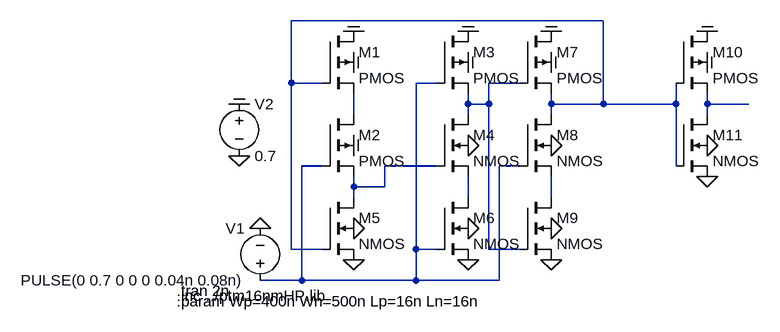
[diagram p0: schematic TSPC_divide-by-2.asc]
TSPC_divide-by-2.asc, the LTspice schematic file:
Version 4
SHEET 1 880 680
WIRE 624 48 144 48
WIRE 144 144 144 48
WIRE 192 144 144 144
WIRE 368 144 336 144
WIRE 496 144 448 144
WIRE 416 176 416 160
WIRE 448 176 448 144
WIRE 448 176 416 176
WIRE 544 176 544 160
WIRE 624 176 624 48
WIRE 624 176 544 176
WIRE 736 176 736 144
WIRE 736 176 624 176
WIRE 784 176 784 160
WIRE 848 176 784 176
WIRE 240 192 240 160
WIRE 416 192 416 176
WIRE 544 192 544 176
WIRE 784 192 784 176
WIRE 192 272 160 272
WIRE 368 272 288 272
WIRE 496 272 464 272
WIRE 736 272 736 176
WIRE 240 304 240 288
WIRE 288 304 288 272
WIRE 288 304 240 304
WIRE 240 320 240 304
WIRE 416 320 416 288
WIRE 544 320 544 288
WIRE 144 400 144 144
WIRE 192 400 144 400
WIRE 336 400 336 144
WIRE 368 400 336 400
WIRE 448 400 448 176
WIRE 496 400 448 400
WIRE 160 448 160 272
WIRE 160 448 96 448
WIRE 336 448 336 400
WIRE 336 448 160 448
WIRE 464 448 464 272
WIRE 464 448 336 448
FLAG 240 416 0
FLAG 240 368 0
FLAG 240 240 COM
FLAG 240 112 COM
FLAG 240 64 COM
FLAG 416 112 COM
FLAG 416 64 COM
FLAG 416 240 0
FLAG 416 416 0
FLAG 416 368 0
FLAG 544 112 COM
FLAG 544 64 COM
FLAG 544 240 0
FLAG 544 416 0
FLAG 544 368 0
FLAG 96 368 0
FLAG 64 176 COM
FLAG 64 256 0
FLAG 784 112 COM
FLAG 784 64 COM
FLAG 784 240 0
FLAG 784 288 0
SYMBOL pmos4 192 64 R0
SYMATTR InstName M1
SYMATTR Value2 l={Lp} w={Wp}
SYMBOL pmos4 192 192 R0
SYMATTR InstName M2
SYMATTR Value2 l={Lp} w={Wp}
SYMBOL nmos4 192 320 R0
SYMATTR InstName M5
SYMATTR Value2 l={Ln} w={Wn}
SYMBOL pmos4 368 64 R0
SYMATTR InstName M3
SYMATTR Value2 l={Lp} w={Wp}
SYMBOL nmos4 368 192 R0
SYMATTR InstName M4
SYMATTR Value2 l={Ln} w={Wn}
SYMBOL nmos4 368 320 R0
SYMATTR InstName M6
SYMATTR Value2 l={Ln} w={Wn}
SYMBOL pmos4 496 64 R0
SYMATTR InstName M7
SYMATTR Value2 l={Lp} w={Wp}
SYMBOL nmos4 496 192 R0
SYMATTR InstName M8
SYMATTR Value2 l={Ln} w={Wn}
SYMBOL nmos4 496 320 R0
SYMATTR InstName M9
SYMATTR Value2 l={Ln} w={Wn}
SYMBOL voltage 96 464 R180
WINDOW 0 24 96 Left 2
WINDOW 3 24 16 Left 2
WINDOW 123 0 0 Left 0
WINDOW 39 0 0 Left 0
SYMATTR InstName V1
SYMATTR Value PULSE(0 0.7 0 0 0 0.04n 0.08n)
SYMBOL voltage 64 160 R0
WINDOW 123 0 0 Left 0
WINDOW 39 0 0 Left 0
SYMATTR InstName V2
SYMATTR Value 0.7
SYMBOL pmos4 736 64 R0
SYMATTR InstName M10
SYMATTR Value2 l=16n w=250n
SYMBOL nmos4 736 192 R0
SYMATTR InstName M11
SYMATTR Value2 l=16n w=100n
TEXT -32 464 Left 2 !.tran 2n
TEXT -32 472 Left 2 !.inc ../ptm16nmHP.lib
TEXT -32 480 Left 2 !.param Wp=400n Wn=500n Lp=16n Ln=16n

The netlist it stands for:
* TSPC_divide-by-2.asc
M1 COM N001 N005 COM PMOS l={Lp} w={Wp}
M2 N005 N002 N006 COM PMOS l={Lp} w={Wp}
M5 N006 N001 0 0 NMOS l={Ln} w={Wn}
M3 COM N002 N003 COM PMOS l={Lp} w={Wp}
M4 N003 N006 N007 0 NMOS l={Ln} w={Wn}
M6 N007 N002 0 0 NMOS l={Ln} w={Wn}
M7 COM N003 N001 COM PMOS l={Lp} w={Wp}
M8 N001 N002 N008 0 NMOS l={Ln} w={Wn}
M9 N008 N003 0 0 NMOS l={Ln} w={Wn}
V1 N002 0 PULSE(0 0.7 0 0 0 0.04n 0.08n)
V2 COM 0 0.7
M10 COM N001 N004 COM PMOS l=16n w=250n
M11 N004 N001 0 0 NMOS l=16n w=100n
.model NMOS NMOS
.model PMOS PMOS
.lib standard.mos
.tran 2n
.inc ../ptm16nmHP.lib
.param Wp=400n Wn=500n Lp=16n Ln=16n
.backanno
.end